# Altium schematic sheet STM32_H750_IO1.SchDoc
size A4; SheetNumber: 2; SheetTotal: 3
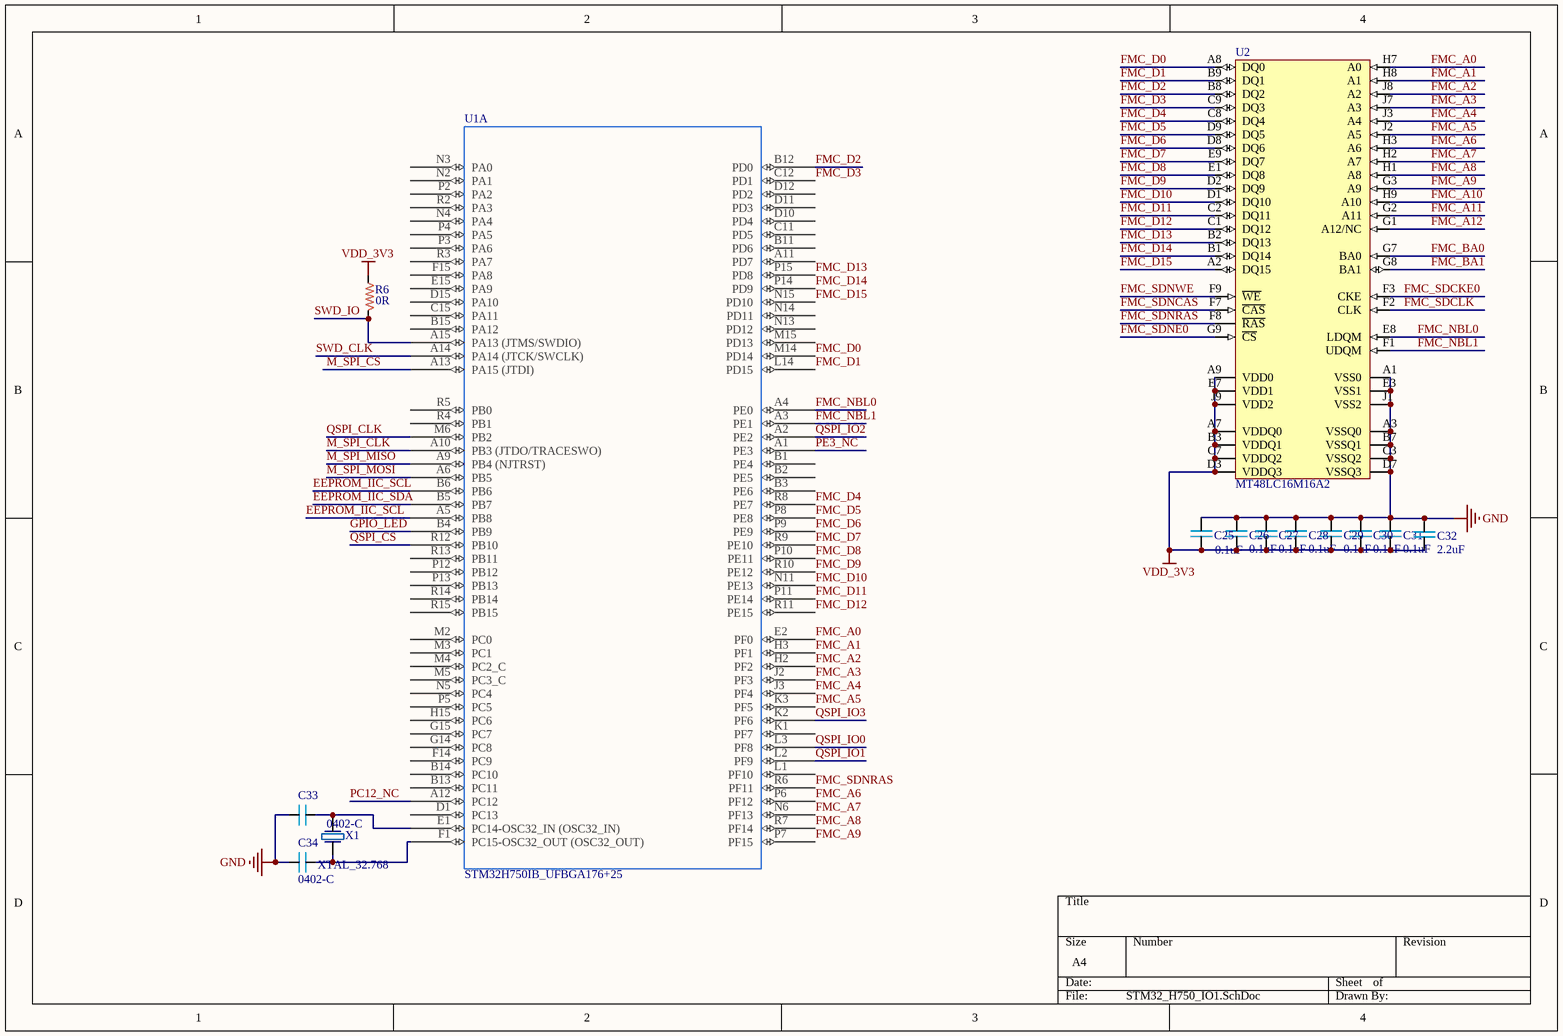
[diagram p0: STM32_H750_IO1.SchDoc]

## Parts
C25  0.1uF  [0402]
C26  0.1uF  [0402]
C27  0.1uF  [0402]
C28  0.1uF  [0402]
C29  0.1uF  [0402]
C30  0.1uF  [0402]
C31  0.1uF  [0402]
C32  2.2uF  [0603P - 2]
C33  0402-C  [0402]
C34  0402-C  [0402]
R6  0R  [0402]
U1  STM32H750IB_UFBGA176+25  [STM32H750IB_UFBGA176+25]  (part A of 3)
U2  MT48LC16M16A2  [BGA-54-L]
X1  XTAL_32.768  [XTAL3215]

## Nets
GND: C25.2 C26.2 C27.2 C28.2 C29.2 C30.2 C31.2 C32.2 C33.2 C34.2 U2.A1(VSS0) U2.A3(VSSQ0) U2.B7(VSSQ1) U2.C3(VSSQ2) U2.D7(VSSQ3) U2.E3(VSS1) U2.J1(VSS2)
VDD_3V3: C25.1 C26.1 C27.1 C28.1 C29.1 C30.1 C31.1 C32.1 R6.1 U2.A7(VDDQ0) U2.A9(VDD0) U2.B3(VDDQ1) U2.C7(VDDQ2) U2.D3(VDDQ3) U2.E7(VDD1) U2.J9(VDD2)
EEPROM_IIC_SCL: U1.A5(PB8) U1.B6(PB6)
EEPROM_IIC_SDA: U1.B5(PB7)
FMC_A0: U1.E2(PF0) U2.H7(A0)
FMC_A1: U1.H3(PF1) U2.H8(A1)
FMC_A2: U1.H2(PF2) U2.J8(A2)
FMC_A3: U1.J2(PF3) U2.J7(A3)
FMC_A4: U1.J3(PF4) U2.J3(A4)
FMC_A5: U1.K3(PF5) U2.J2(A5)
FMC_A6: U1.P6(PF12) U2.H3(A6)
FMC_A7: U1.N6(PF13) U2.H2(A7)
FMC_A8: U1.R7(PF14) U2.H1(A8)
FMC_A9: U1.P7(PF15) U2.G3(A9)
FMC_A10: U2.H9(A10)
FMC_A11: U2.G2(A11)
FMC_A12: U2.G1(A12/NC)
FMC_BA0: U2.G7(BA0)
FMC_BA1: U2.G8(BA1)
FMC_D0: U1.M14(PD14) U2.A8(DQ0)
FMC_D1: U1.L14(PD15) U2.B9(DQ1)
FMC_D2: U1.B12(PD0) U2.B8(DQ2)
FMC_D3: U1.C12(PD1) U2.C9(DQ3)
FMC_D4: U1.R8(PE7) U2.C8(DQ4)
FMC_D5: U1.P8(PE8) U2.D9(DQ5)
FMC_D6: U1.P9(PE9) U2.D8(DQ6)
FMC_D7: U1.R9(PE10) U2.E9(DQ7)
FMC_D8: U1.P10(PE11) U2.E1(DQ8)
FMC_D9: U1.R10(PE12) U2.D2(DQ9)
FMC_D10: U1.N11(PE13) U2.D1(DQ10)
FMC_D11: U1.P11(PE14) U2.C2(DQ11)
FMC_D12: U1.R11(PE15) U2.C1(DQ12)
FMC_D13: U1.P15(PD8) U2.B2(DQ13)
FMC_D14: U1.P14(PD9) U2.B1(DQ14)
FMC_D15: U1.N15(PD10) U2.A2(DQ15)
FMC_NBL0: U1.A4(PE0) U2.E8(LDQM)
FMC_NBL1: U1.A3(PE1) U2.F1(UDQM)
FMC_SDCKE0: U2.F3(CKE)
FMC_SDCLK: U2.F2(CLK)
FMC_SDNCAS: U2.F7(~{CAS})
FMC_SDNE0: U2.G9(~{CS})
FMC_SDNRAS: U1.R6(PF11) U2.F8(~{RAS})
FMC_SDNWE: U2.F9(~{WE})
GPIO_LED: U1.B4(PB9)
M_SPI_CLK: U1.A10(PB3_(JTDO/TRACESWO))
M_SPI_CS: U1.A13(PA15_(JTDI))
M_SPI_MISO: U1.A9(PB4_(NJTRST))
M_SPI_MOSI: U1.A6(PB5)
PC12_NC: U1.A12(PC12)
PE3_NC: U1.A1(PE3)
QSPI_CLK: U1.M6(PB2)
QSPI_CS: U1.R12(PB10)
QSPI_IO0: U1.L3(PF8)
QSPI_IO1: U1.L2(PF9)
QSPI_IO2: U1.A2(PE2)
QSPI_IO3: U1.K2(PF6)
SWD_CLK: U1.A14(PA14_(JTCK/SWCLK))
SWD_IO: R6.2 U1.A15(PA13_(JTMS/SWDIO))
NetC33_1: C33.1 U1.E1(PC14-OSC32_IN_(OSC32_IN)) X1.1
NetC34_1: C34.1 U1.F1(PC15-OSC32_OUT_(OSC32_OUT)) X1.2

Not connected (* = marked no-connect by the designer): U1 A11(PD7) B1(PE4) B2(PE5) B3(PE6) B11(PD6) B13(PC11) B14(PC10) B15(PA12) C11(PD5) C15(PA11) D1(PC13) D10(PD4) D11(PD3) D12(PD2) D15(PA10) E15(PA9) F14(PC9) F15(PA8) G14(PC8) G15(PC7) H15(PC6) K1(PF7) L1(PF10) M2(PC0) M3(PC1) M4(PC2_C) M5(PC3_C) M15(PD13) N2(PA1) N3(PA0) N4(PA4) N5(PC4) N13(PD12) N14(PD11) P2(PA2) P3(PA6) P4(PA5) P5(PC5) P12(PB12) P13(PB13) R2(PA3) R3(PA7) R4(PB1) R5(PB0) R13(PB11) R14(PB14) R15(PB15)

## Library data of the parts
C25-C31 = 0402-C
C32 = 0603-C_Min
R6 = 0402-R
U2 = MT48LC16M16A2: 32MB SDRAM
X1 = XTAL_32.768: 32.768晶振
U1 = STM32H750IB_UFBGA176+25: ComponentLink1Description: New link; ComponentLink1URL: *